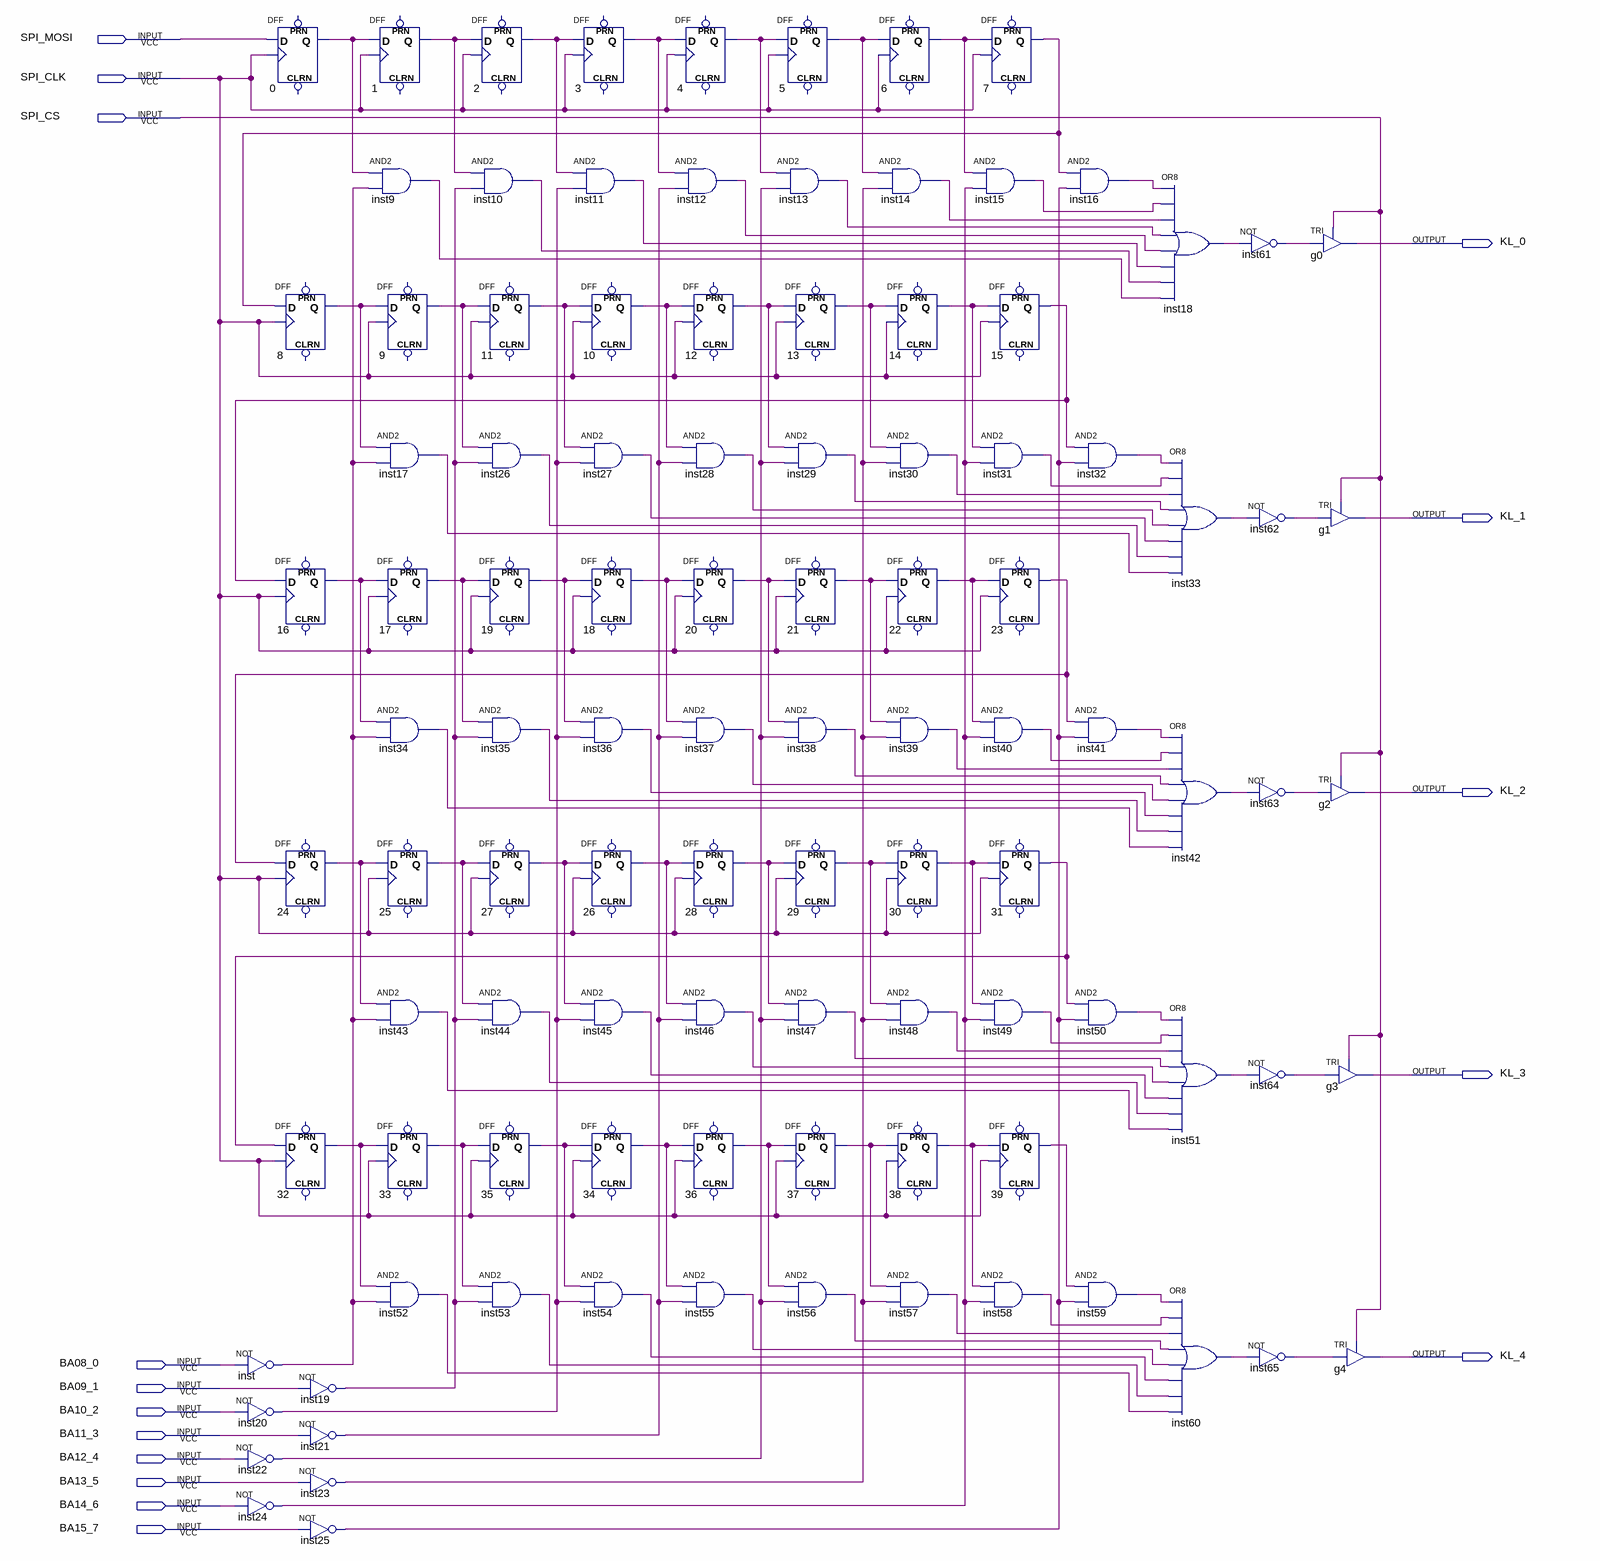
[diagram p0: schematic sheet]
// Quartus schematic spi2kb5x8.bdf as structural Verilog: 103 symbols, 16 pins
module spi2kb5x8 (
  input  SPI_MOSI,
  input  SPI_CLK,
  input  SPI_CS,
  input  BA08_0,
  input  BA09_1,
  input  BA10_2,
  input  BA11_3,
  input  BA12_4,
  input  BA13_5,
  input  BA14_6,
  input  BA15_7,
  output KL_0,
  output KL_1,
  output KL_2,
  output KL_3,
  output KL_4
);

  wire inst9_out, inst10_out, inst11_out, inst12_out, inst13_out, inst14_out, inst15_out, inst16_out,
       inst17_out, inst18_out, inst19_out, inst20_out, inst21_out, inst22_out, inst23_out, inst24_out,
       inst25_out, inst26_out, inst27_out, inst28_out, inst29_out, inst30_out, inst31_out, inst32_out,
       inst33_out, inst34_out, inst35_out, inst36_out, inst37_out, inst38_out, inst39_out, inst40_out,
       inst41_out, inst42_out, inst43_out, inst44_out, inst45_out, inst46_out, inst47_out, inst48_out,
       inst49_out, inst50_out, inst51_out, inst52_out, inst53_out, inst54_out, inst55_out, inst56_out,
       inst57_out, inst58_out, inst59_out, inst60_out, inst61_out, inst62_out, inst63_out, inst64_out,
       inst65_out, inst_out, n0_q, n1_q, n2_q, n3_q, n4_q, n5_q, n6_q, n7_q, n8_q, n9_q, n10_q, n11_q, n12_q,
       n13_q, n14_q, n15_q, n16_q, n17_q, n18_q, n19_q, n20_q, n21_q, n22_q, n23_q, n24_q, n25_q, n26_q,
       n27_q, n28_q, n29_q, n30_q, n31_q, n32_q, n33_q, n34_q, n35_q, n36_q, n37_q, n38_q, n39_q;

  not inst (inst_out, BA08_0);
  not inst20 (inst20_out, BA10_2);
  not inst22 (inst22_out, BA12_4);
  not inst24 (inst24_out, BA14_6);
  DFF u_0 (.CLK(SPI_CLK), .D(SPI_MOSI), .Q(n0_q));  // open: CLRN, PRN
  DFF u_8 (.CLK(SPI_CLK), .D(n7_q), .Q(n8_q));  // open: CLRN, PRN
  DFF u_16 (.CLK(SPI_CLK), .D(n15_q), .Q(n16_q));  // open: CLRN, PRN
  DFF u_24 (.CLK(SPI_CLK), .D(n23_q), .Q(n24_q));  // open: CLRN, PRN
  DFF u_32 (.CLK(SPI_CLK), .D(n31_q), .Q(n32_q));  // open: CLRN, PRN
  not inst19 (inst19_out, BA09_1);
  not inst21 (inst21_out, BA11_3);
  not inst23 (inst23_out, BA13_5);
  not inst25 (inst25_out, BA15_7);
  DFF u_1 (.CLK(SPI_CLK), .D(n0_q), .Q(n1_q));  // open: CLRN, PRN
  and inst9 (inst9_out, n0_q, inst_out);
  DFF u_9 (.CLK(SPI_CLK), .D(n8_q), .Q(n9_q));  // open: CLRN, PRN
  and inst17 (inst17_out, n8_q, inst_out);
  DFF u_17 (.CLK(SPI_CLK), .D(n16_q), .Q(n17_q));  // open: CLRN, PRN
  and inst34 (inst34_out, n16_q, inst_out);
  DFF u_25 (.CLK(SPI_CLK), .D(n24_q), .Q(n25_q));  // open: CLRN, PRN
  and inst43 (inst43_out, n24_q, inst_out);
  DFF u_33 (.CLK(SPI_CLK), .D(n32_q), .Q(n33_q));  // open: CLRN, PRN
  and inst52 (inst52_out, n32_q, inst_out);
  DFF u_2 (.CLK(SPI_CLK), .D(n1_q), .Q(n2_q));  // open: CLRN, PRN
  and inst10 (inst10_out, n1_q, inst19_out);
  DFF u_11 (.CLK(SPI_CLK), .D(n9_q), .Q(n11_q));  // open: CLRN, PRN
  and inst26 (inst26_out, n9_q, inst19_out);
  DFF u_19 (.CLK(SPI_CLK), .D(n17_q), .Q(n19_q));  // open: CLRN, PRN
  and inst35 (inst35_out, n17_q, inst19_out);
  DFF u_27 (.CLK(SPI_CLK), .D(n25_q), .Q(n27_q));  // open: CLRN, PRN
  and inst44 (inst44_out, n25_q, inst19_out);
  DFF u_35 (.CLK(SPI_CLK), .D(n33_q), .Q(n35_q));  // open: CLRN, PRN
  and inst53 (inst53_out, n33_q, inst19_out);
  DFF u_3 (.CLK(SPI_CLK), .D(n2_q), .Q(n3_q));  // open: CLRN, PRN
  and inst11 (inst11_out, n2_q, inst20_out);
  DFF u_10 (.CLK(SPI_CLK), .D(n11_q), .Q(n10_q));  // open: CLRN, PRN
  and inst27 (inst27_out, n11_q, inst20_out);
  DFF u_18 (.CLK(SPI_CLK), .D(n19_q), .Q(n18_q));  // open: CLRN, PRN
  and inst36 (inst36_out, n19_q, inst20_out);
  DFF u_26 (.CLK(SPI_CLK), .D(n27_q), .Q(n26_q));  // open: CLRN, PRN
  and inst45 (inst45_out, n27_q, inst20_out);
  DFF u_34 (.CLK(SPI_CLK), .D(n35_q), .Q(n34_q));  // open: CLRN, PRN
  and inst54 (inst54_out, n35_q, inst20_out);
  DFF u_4 (.CLK(SPI_CLK), .D(n3_q), .Q(n4_q));  // open: CLRN, PRN
  and inst12 (inst12_out, n3_q, inst21_out);
  DFF u_12 (.CLK(SPI_CLK), .D(n10_q), .Q(n12_q));  // open: CLRN, PRN
  and inst28 (inst28_out, n10_q, inst21_out);
  DFF u_20 (.CLK(SPI_CLK), .D(n18_q), .Q(n20_q));  // open: CLRN, PRN
  and inst37 (inst37_out, n18_q, inst21_out);
  DFF u_28 (.CLK(SPI_CLK), .D(n26_q), .Q(n28_q));  // open: CLRN, PRN
  and inst46 (inst46_out, n26_q, inst21_out);
  DFF u_36 (.CLK(SPI_CLK), .D(n34_q), .Q(n36_q));  // open: CLRN, PRN
  and inst55 (inst55_out, n34_q, inst21_out);
  DFF u_5 (.CLK(SPI_CLK), .D(n4_q), .Q(n5_q));  // open: CLRN, PRN
  and inst13 (inst13_out, n4_q, inst22_out);
  DFF u_13 (.CLK(SPI_CLK), .D(n12_q), .Q(n13_q));  // open: CLRN, PRN
  and inst29 (inst29_out, n12_q, inst22_out);
  DFF u_21 (.CLK(SPI_CLK), .D(n20_q), .Q(n21_q));  // open: CLRN, PRN
  and inst38 (inst38_out, n20_q, inst22_out);
  DFF u_29 (.CLK(SPI_CLK), .D(n28_q), .Q(n29_q));  // open: CLRN, PRN
  and inst47 (inst47_out, n28_q, inst22_out);
  DFF u_37 (.CLK(SPI_CLK), .D(n36_q), .Q(n37_q));  // open: CLRN, PRN
  and inst56 (inst56_out, n36_q, inst22_out);
  DFF u_6 (.CLK(SPI_CLK), .D(n5_q), .Q(n6_q));  // open: CLRN, PRN
  and inst14 (inst14_out, n5_q, inst23_out);
  DFF u_14 (.CLK(SPI_CLK), .D(n13_q), .Q(n14_q));  // open: CLRN, PRN
  and inst30 (inst30_out, n13_q, inst23_out);
  DFF u_22 (.CLK(SPI_CLK), .D(n21_q), .Q(n22_q));  // open: CLRN, PRN
  and inst39 (inst39_out, n21_q, inst23_out);
  DFF u_30 (.CLK(SPI_CLK), .D(n29_q), .Q(n30_q));  // open: CLRN, PRN
  and inst48 (inst48_out, n29_q, inst23_out);
  DFF u_38 (.CLK(SPI_CLK), .D(n37_q), .Q(n38_q));  // open: CLRN, PRN
  and inst57 (inst57_out, n37_q, inst23_out);
  DFF u_7 (.CLK(SPI_CLK), .D(n6_q), .Q(n7_q));  // open: CLRN, PRN
  and inst15 (inst15_out, n6_q, inst24_out);
  DFF u_15 (.CLK(SPI_CLK), .D(n14_q), .Q(n15_q));  // open: CLRN, PRN
  and inst31 (inst31_out, n14_q, inst24_out);
  DFF u_23 (.CLK(SPI_CLK), .D(n22_q), .Q(n23_q));  // open: CLRN, PRN
  and inst40 (inst40_out, n22_q, inst24_out);
  DFF u_31 (.CLK(SPI_CLK), .D(n30_q), .Q(n31_q));  // open: CLRN, PRN
  and inst49 (inst49_out, n30_q, inst24_out);
  DFF u_39 (.CLK(SPI_CLK), .D(n38_q), .Q(n39_q));  // open: CLRN, PRN
  and inst58 (inst58_out, n38_q, inst24_out);
  and inst16 (inst16_out, n7_q, inst25_out);
  and inst32 (inst32_out, n15_q, inst25_out);
  and inst41 (inst41_out, n23_q, inst25_out);
  and inst50 (inst50_out, n31_q, inst25_out);
  and inst59 (inst59_out, n39_q, inst25_out);
  or inst18 (inst18_out, inst16_out, inst15_out, inst14_out, inst13_out, inst12_out, inst11_out, inst10_out, inst9_out);
  or inst33 (inst33_out, inst32_out, inst31_out, inst30_out, inst29_out, inst28_out, inst27_out, inst26_out, inst17_out);
  or inst42 (inst42_out, inst41_out, inst40_out, inst39_out, inst38_out, inst37_out, inst36_out, inst35_out, inst34_out);
  or inst51 (inst51_out, inst50_out, inst49_out, inst48_out, inst47_out, inst46_out, inst45_out, inst44_out, inst43_out);
  or inst60 (inst60_out, inst59_out, inst58_out, inst57_out, inst56_out, inst55_out, inst54_out, inst53_out, inst52_out);
  not inst61 (inst61_out, inst18_out);
  not inst62 (inst62_out, inst33_out);
  not inst63 (inst63_out, inst42_out);
  not inst64 (inst64_out, inst51_out);
  not inst65 (inst65_out, inst60_out);
  TRI g0 (.IN(inst61_out), .OE(SPI_CS), .OUT(KL_0));
  TRI g1 (.IN(inst62_out), .OE(SPI_CS), .OUT(KL_1));
  TRI g2 (.IN(inst63_out), .OE(SPI_CS), .OUT(KL_2));
  TRI g3 (.IN(inst64_out), .OE(SPI_CS), .OUT(KL_3));
  TRI g4 (.IN(inst65_out), .OE(SPI_CS), .OUT(KL_4));
endmodule
